# Altium project FLS Data Formatter 8_14_2012.PrjPCB
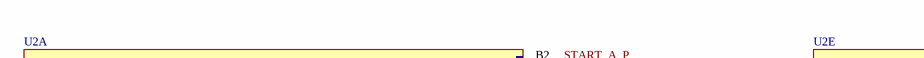
[diagram p0: M2FS FLS Data Formatter 8_14_2012.SchDoc, top right]
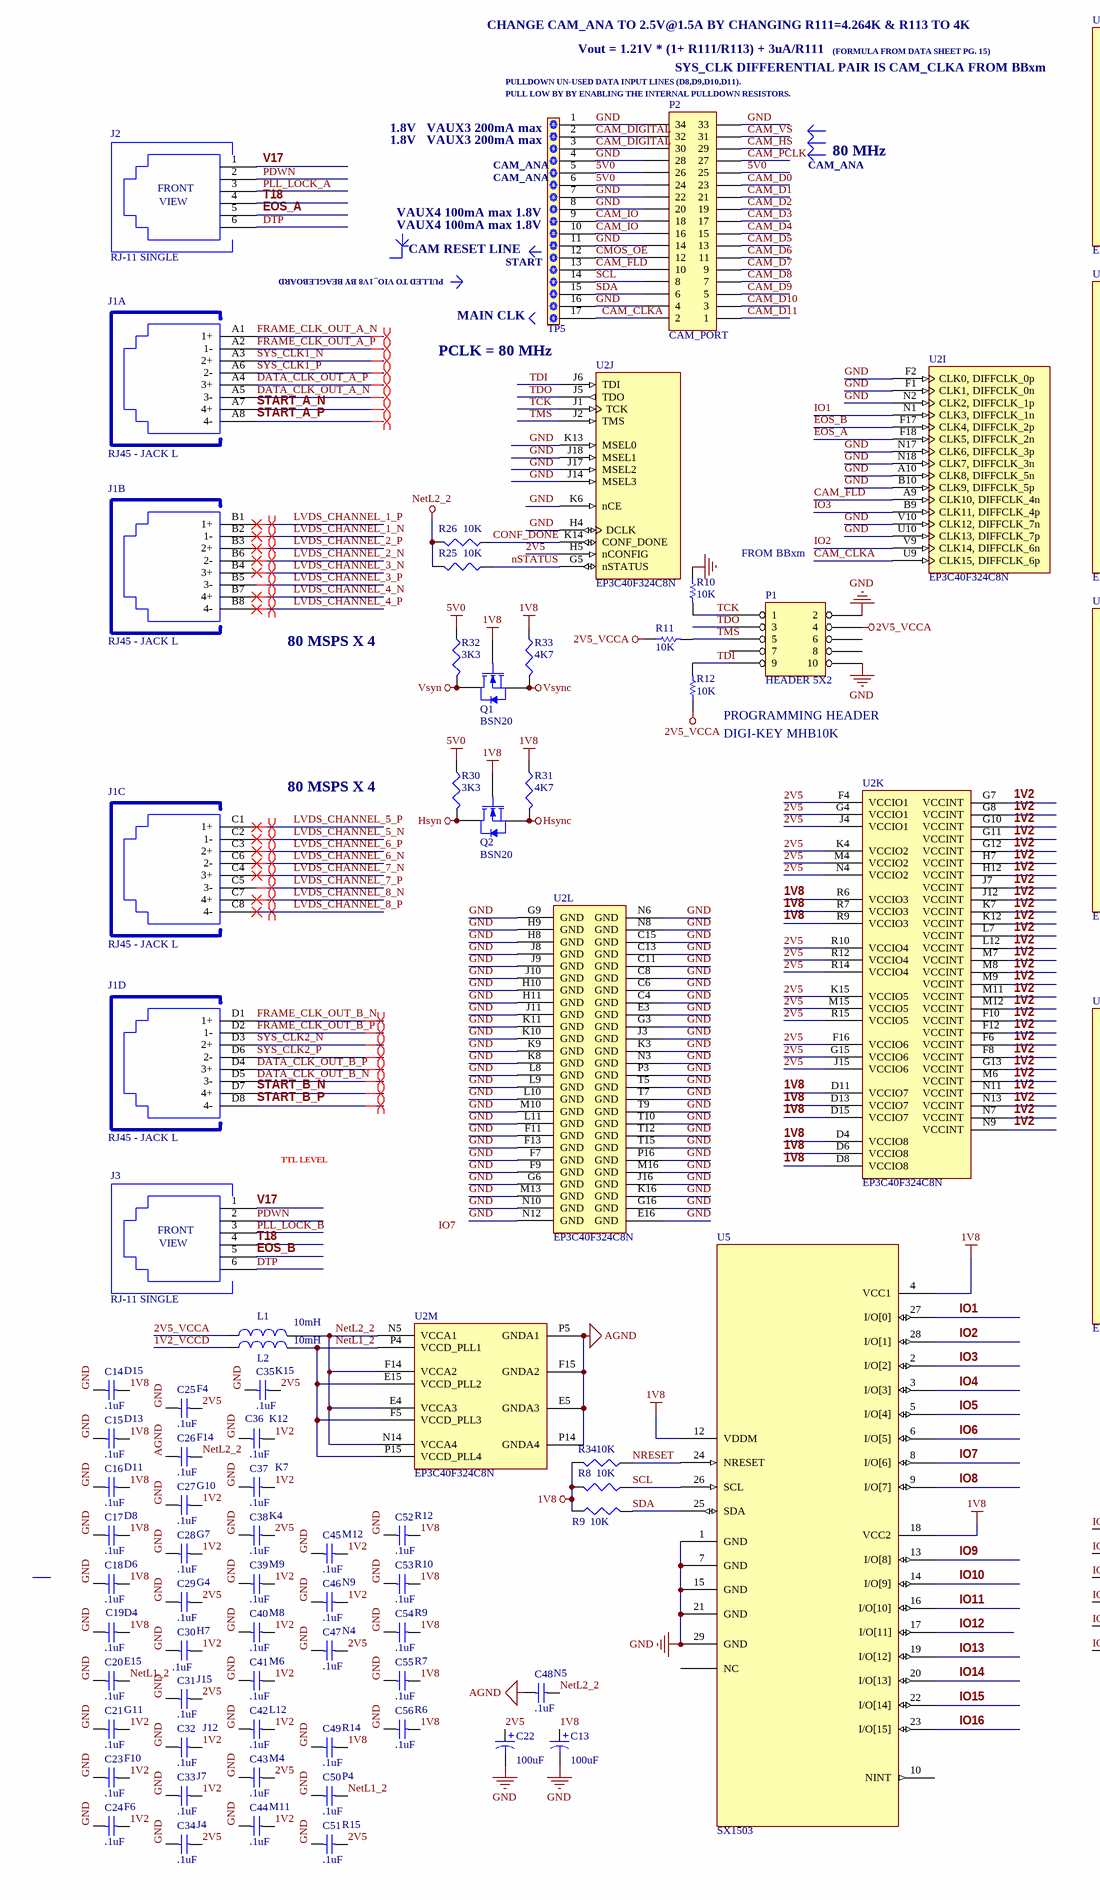
[diagram p1: M2FS FLS Data Formatter 8_14_2012.SchDoc, bottom left]
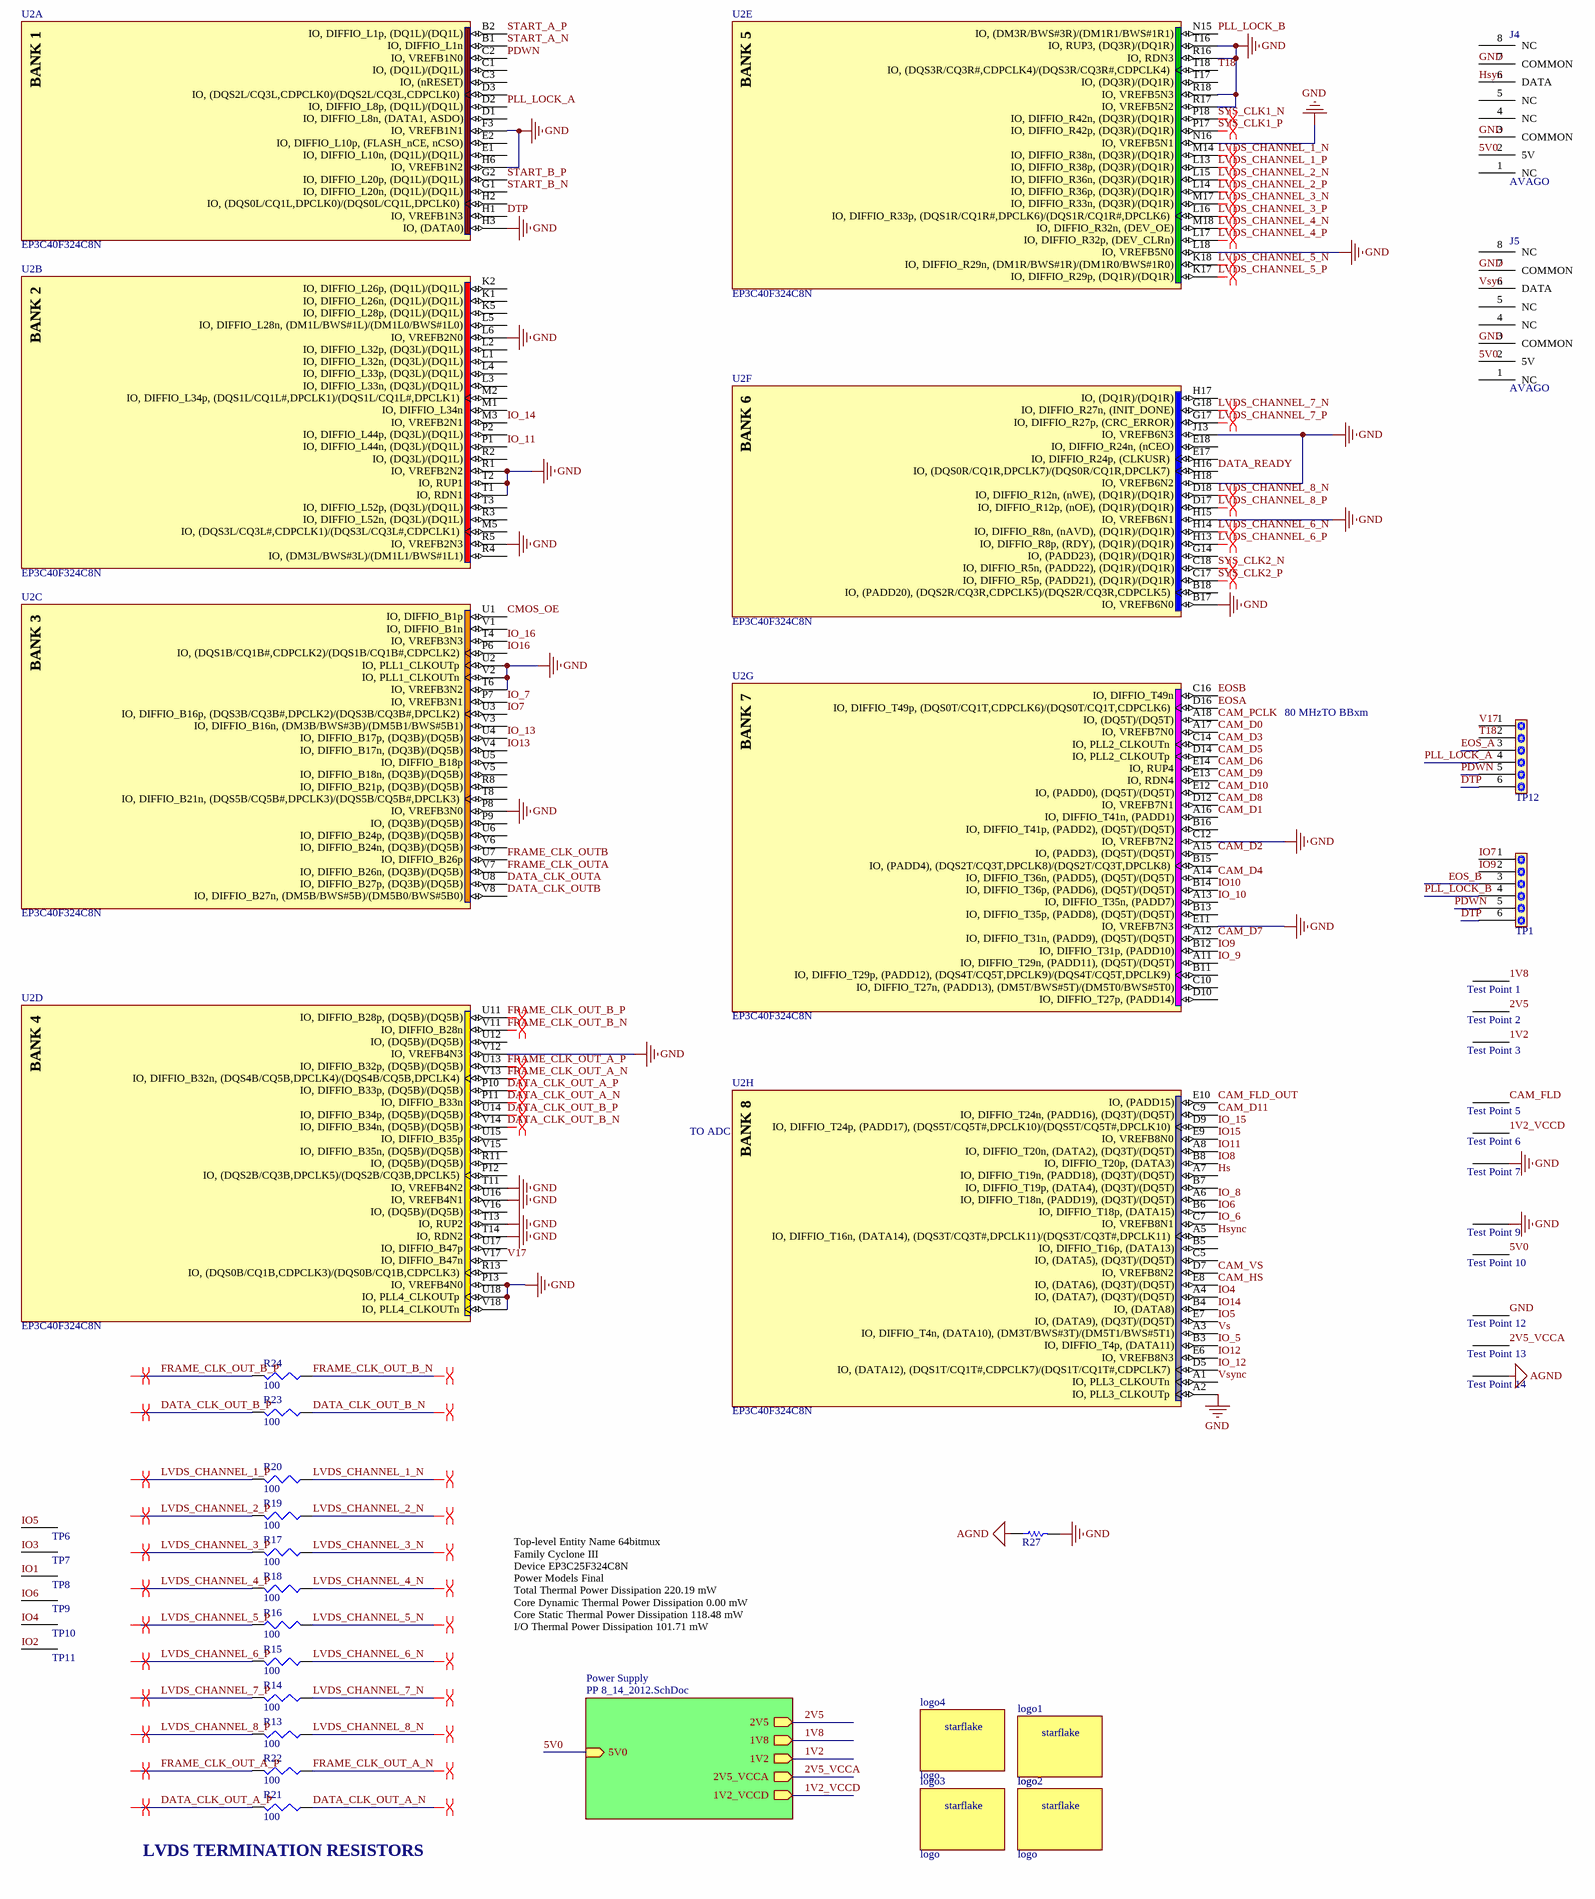
[diagram p2: M2FS FLS Data Formatter 8_14_2012.SchDoc, bottom right]
2 sheets, 134 parts. Net scope: hierarchical (ports join the sheet entries above them; power ports are global).
Board file: M2FS FLS Data Formatter 8_14_2012.PcbDoc
Sheets:
  M2FS FLS Data Formatter 8_14_2012.SchDoc
    Power Supply = PP 8_14_2012.SchDoc

## Sheet M2FS FLS Data Formatter 8_14_2012.SchDoc
size 558 x 401 mm; Organization: Carnegie Institution of Washington; DocumentNumber: 2; SheetNumber: 2; SheetTotal: 2; CompanyName: Carnegie Observatories; DrawnBy: alanb; Engineer: Alan Bagish; PageSetup: Record=PageOptions|CenterHorizontal=True|CenterVertical=True|PrintScale=0.47|XCorrection=1.00|YCorrection=1.00|PrintKind=0|BorderSize=5000000|LeftOffset=0|BottomOffset=0|Orientation=2|PaperLength=1000|PaperWidth=1000|Scale=100|PaperSource=259|PrintQuality=600|MediaType=1|DitherType=10|PaperKind=Letter (8.5 x 11")|PrintScaleMode=1; DocumentName: FLS FRONT END

### Parts
C13  100uF  [1206]
C14  value .1uF  Ball: D15  [0402 slim]  (hidden comment: 0.1uF)
C15  value .1uF  Ball: D13  [0402 slim]  (hidden comment: 0.1uF)
C16  value .1uF  Ball: D11  [0402 slim-B]  (hidden comment: 0.1uF)
C17  value .1uF  Ball: D8  [0402 slim]  (hidden comment: 0.1uF)
C18  value .1uF  Ball: D6  [0402 slim-B]  (hidden comment: 0.1uF)
C19  value .1uF  Ball: D4  [0402 slim]  (hidden comment: 0.1uF)
C20  value .1uF  Ball: E15  [0402 slim-B]  (hidden comment: 0.1uF)
C21  value .1uF  Ball: G11  [0402 slim]  (hidden comment: 0.1uF)
C22  100uF  [1206]
C23  value .1uF  Ball: F10  [0402 slim-B]  (hidden comment: 0.1uF)
C24  value .1uF  Ball: F6  [0402 slim]  (hidden comment: 0.1uF)
C25  value .1uF  Ball: F4  [0402 slim]  (hidden comment: 0.1uF)
C26  value .1uF  Ball: F14  [0402 slim]  (hidden comment: 0.1uF)
C27  value .1uF  Ball: G10  [0402 slim]  (hidden comment: 0.1uF)
C28  value .1uF  Ball: G7  [0402 slim-B]  (hidden comment: 0.1uF)
C29  value .1uF  Ball: G4  [0402 slim]  (hidden comment: 0.1uF)
C30  value .1uF  Ball: H7  [0402 slim-B]  (hidden comment: 0.1uF)
C31  value .1uF  Ball: J15  [0402 slim]  (hidden comment: 0.1uF)
C32  value .1uF  Ball: J12  [0402 slim-B]  (hidden comment: 0.1uF)
C33  value .1uF  Ball: J7  [0402 slim-B]  (hidden comment: 0.1uF)
C34  value .1uF  C34: J4  [0402 slim]  (hidden comment: 0.1uF)
C35  value .1uF  Ball: K15  [0402 slim]  (hidden comment: 0.1uF)
C36  value .1uF  Ball: K12  [0402 slim]  (hidden comment: 0.1uF)
C37  value .1uF  Ball: K7  [0402 slim-B]  (hidden comment: 0.1uF)
C38  value .1uF  Ball: K4  [0402 slim]  (hidden comment: 0.1uF)
C39  value .1uF  Ball: M9  [0402 slim]  (hidden comment: 0.1uF)
C40  value .1uF  Ball: M8  [0402 slim-B]  (hidden comment: 0.1uF)
C41  value .1uF  Ball: M6  [0402 slim]  (hidden comment: 0.1uF)
C42  value .1uF  Ball: L12  [0402 slim]  (hidden comment: 0.1uF)
C43  value .1uF  Ball: M4  [0402 slim]  (hidden comment: 0.1uF)
C44  value .1uF  Ball: M11  [0402 slim]  (hidden comment: 0.1uF)
C45  value .1uF  Ball: M12  [0402 slim-B]  (hidden comment: 0.1uF)
C46  value .1uF  Ball: N9  [0402 slim]  (hidden comment: 0.1uF)
C47  value .1uF  Bal: N4  [0402 slim]  (hidden comment: 0.1uF)
C48  value .1uF  Ball: N5  [0402 slim]  (hidden comment: 0.1uF)
C49  value .1uF  Ball: R14  [0402 slim]  (hidden comment: 0.1uF)
C50  value .1uF  Ball: P4  [0402 slim]  (hidden comment: 0.1uF)
C51  value .1uF  Ball: R15  [0402 slim]  (hidden comment: 0.1uF)
C52  value .1uF  Ball: R12  [0402 slim]  (hidden comment: 0.1uF)
C53  value .1uF  Ball: R10  [0402 slim]  (hidden comment: 0.1uF)
C54  value .1uF  Ball: R9  [0402 slim]  (hidden comment: 0.1uF)
C55  value .1uF  Ball: R7  [0402 slim]  (hidden comment: 0.1uF)
C56  value .1uF  Ball: R6  [0402 slim]  (hidden comment: 0.1uF)
J1  RJ45 - JACK L  [5558503-1 Quad RJ45 Jack]  (parts A,B,C,D of 4)
J2  RJ-11 SINGLE  [RJ11 - 5555140-1]
J3  RJ-11 SINGLE  [RJ11 - 5555140-1]
J4  AVAGO  [HFBR-2412Z]
J5  AVAGO  [HFBR-2412Z]
L1  value 10mH  [0805]  (hidden comment: Inductor)
L2  value 10mH  [0805]  (hidden comment: Inductor)
logo1  logo  [STARFLAKE]
logo2  logo  [STARFLAKE]
logo3  logo  [STARFLAKE]
logo4  logo  [STARFLAKE]
P1  HEADER 5X2  [HDR2X5]
P2  CAM_PORT  [CON34_.05X.05]
Q1  BSN20  [SOT23]
Q2  BSN20  [SOT23]
R8  10K  [0402 slim]
R9  10K  [0402 slim]
R10  10K  [6-0805]
R11  10K  [6-0805]
R12  10K  [6-0805]
R13  100  [0402 slim]
R14  100  [0402 slim]
R15  100  [0402 slim]
R16  100  [0402 slim]
R17  100  [0402 one-of]
R18  100  [0402 slim]
R19  100  [0402 slim]
R20  100  [0402 slim]
R21  100  [0402 slim]
R22  100  [0402 slim]
R23  100  [0402 slim]
R24  100  [0402 slim]
R25  10K  [0805]
R26  10K  [0805]
R27  0R5 0805(2012)  [RESC0805(2012)_N]  (value not drawn)
R30  3K3  [0805]
R31  4K7  [0805]
R32  3K3  [0805]
R33  4K7  [0805]
R34  10K  [0402 slim]
Test_Point_1  TP-107  (value not drawn)
Test_Point_2  TP-107  (value not drawn)
Test_Point_3  TP-107  (value not drawn)
Test_Point_5  TP-107  (value not drawn)
Test_Point_6  TP-107  [TP-107]  (value not drawn)
Test_Point_7  TP-107  (value not drawn)
Test_Point_9  TP-107  (value not drawn)
Test_Point_10  TP-107  (value not drawn)
Test_Point_12  TP-107  [TP-107]  (value not drawn)
Test_Point_13  TP-107  [TP-107]  (value not drawn)
Test_Point_14  TP-107  [TP-107]  (value not drawn)
TP1  TP6  [TP6]  (value not drawn)
TP5  TP17  [TP17]  (value not drawn)
TP6  IO5  [TP1]  (value not drawn)
TP7  IO3  [TP1]  (value not drawn)
TP8  IO1  [TP1]  (value not drawn)
TP9  IO6  [TP1]  (value not drawn)
TP10  IO4  [TP1]  (value not drawn)
TP11  IO2  [TP1]  (value not drawn)
TP12  TP6  [TP6]  (value not drawn)
U2  EP3C40F324C8N  [FBGA324]  (parts A,B,C,D,E,F,G,H,I,J,K,L,M of 13)
U5  SX1503  [QFN-UT28]

### Sub-sheets
Power Supply = PP 8_14_2012.SchDoc: 5V0 (in), 2V5 (out), 1V8 (out), 1V2 (out), 1V2_VCCD (out), 2V5_VCCA (out)

### Nets
1V8: C13.1 C14.1 C15.1 C16.2 C17.1 C18.2 C19.1 C49.1 C52.1 C53.1 C54.1 C55.1 C56.1 Q1.1(G) Q2.1(G) R8.2 R9.1 R31.1 R33.1 R34.2 Test_Point_1.1 U2.D4(VCCIO8) U2.D6(VCCIO8) U2.D8(VCCIO8) U2.D11(VCCIO7) U2.D13(VCCIO7) U2.D15(VCCIO7) U2.R6(VCCIO3) U2.R7(VCCIO3) U2.R9(VCCIO3) U5.4(VCC1) U5.12(VDDM) U5.18(VCC2) ; sheet Power Supply/1V8
2V5_VCCA: L1.1 P1.4 R11.1 R12.1 Test_Point_13.1 ; sheet Power Supply/2V5_VCCA
5V0: J4.2(5V) J5.2(5V) P2.24 P2.25 P2.26 R30.1 R32.1 Test_Point_10.1 TP5.5 TP5.6 ; sheet Power Supply/5V0
AGND: C26.2 C48.2 R27.1 Test_Point_14.1 U2.E5(GNDA3) U2.F15(GNDA2) U2.P5(GNDA1) U2.P14(GNDA4)
GND: C13.2 C14.2 C15.2 C16.1 C17.2 C18.1 C19.2 C20.1 C21.2 C22.2 C23.1 C24.2 C25.2 C27.2 C28.1 C29.2 C30.1 C31.1 C32.1 C33.1 C34.2 C35.2 C36.2 C37.1 C38.2 C39.2 C40.1 C41.2 C42.2 C43.2 C44.2 C45.1 C46.2 C47.2 C49.2 C50.2 C51.1 C52.2 C53.2 C54.2 C55.2 C56.2 J4.3(COMMON) J4.7(COMMON) J5.3(COMMON) J5.7(COMMON) P1.2 P1.10 P2.4 P2.14 P2.20 P2.22 P2.28 P2.33 P2.34 R10.1 R27.2 Test_Point_7.1 Test_Point_9.1 Test_Point_12.1 TP5.1 TP5.4 TP5.7 TP5.8 TP5.11 TP5.16 U2.A2(IO,_PLL3_CLKOUTp) U2.A10(CLK8,_DIFFCLK_5n) U2.B10(CLK9,_DIFFCLK_5p) U2.B17(IO,_VREFB6N0) U2.C4(GND) U2.C6(GND) U2.C8(GND) U2.C11(GND) U2.C12(IO,_VREFB7N2) U2.C13(GND) U2.C15(GND) U2.E3(GND) U2.E11(IO,_VREFB7N3) U2.E16(GND) U2.F1(CLK1,_DIFFCLK_0n) U2.F2(CLK0,_DIFFCLK_0p) U2.F3(IO,_VREFB1N1) U2.F7(GND) U2.F9(GND) U2.F11(GND) U2.F13(GND) U2.G3(GND) U2.G6(GND) U2.G9(GND) U2.G16(GND) U2.H3(IO,_(DATA0)) U2.H4(DCLK) U2.H6(IO,_VREFB1N2) U2.H8(GND) U2.H9(GND) U2.H10(GND) U2.H11(GND) U2.H15(IO,_VREFB6N1) U2.H18(IO,_VREFB6N2) U2.J3(GND) U2.J8(GND) U2.J9(GND) U2.J10(GND) U2.J11(GND) U2.J13(IO,_VREFB6N3) U2.J14(MSEL3) U2.J16(GND) U2.J17(MSEL2) U2.J18(MSEL1) U2.K3(GND) U2.K6(nCE) U2.K8(GND) U2.K9(GND) U2.K10(GND) U2.K11(GND) U2.K13(MSEL0) U2.K16(GND) U2.L6(IO,_VREFB2N0) U2.L8(GND) U2.L9(GND) U2.L10(GND) U2.L11(GND) U2.L18(IO,_VREFB5N0) U2.M10(GND) U2.M13(GND) U2.M16(GND) U2.N2(CLK2,_DIFFCLK_1p) U2.N3(GND) U2.N6(GND) U2.N8(GND) U2.N10(GND) U2.N12(GND) U2.N16(IO,_VREFB5N1) U2.N17(CLK6,_DIFFCLK_3p) U2.N18(CLK7,_DIFFCLK_3n) U2.P3(GND) U2.P8(IO,_VREFB3N0) U2.P13(IO,_VREFB4N0) U2.P16(GND) U2.R1(IO,_VREFB2N2) U2.R5(IO,_VREFB2N3) U2.R16(IO,_RDN3) U2.R17(IO,_VREFB5N2) U2.R18(IO,_VREFB5N3) U2.T1(IO,_RDN1) U2.T2(IO,_RUP1) U2.T5(GND) U2.T6(IO,_VREFB3N2) U2.T7(GND) U2.T9(GND) U2.T10(GND) U2.T11(IO,_VREFB4N2) U2.T12(GND) U2.T13(IO,_RUP2) U2.T14(IO,_RDN2) U2.T15(GND) U2.T16(IO,_RUP3,_(DQ3R)/(DQ1R)) U2.U2(IO,_PLL1_CLKOUTp) U2.U10(CLK13,_DIFFCLK_7p) U2.U16(IO,_VREFB4N1) U2.U18(IO,_PLL4_CLKOUTp) U2.V2(IO,_PLL1_CLKOUTn) U2.V10(CLK12,_DIFFCLK_7n) U2.V12(IO,_VREFB4N3) U2.V18(IO,_PLL4_CLKOUTn) U5.1(GND) U5.7(GND) U5.15(GND) U5.21(GND) U5.29(GND)
Hsyn: J4.6(DATA) Q2.3(D) R30.2
Hsync: Q2.2(S) R31.2 U2.A5(IO,_DIFFIO_T16n,_(DATA14),_(DQS3T/CQ3T#,DPCLK11)/(DQS3T/CQ3T#,DPCLK11))
NetL2_2: C26.1 C48.1 L1.2 R25.2 R26.2 U2.E4(VCCA3) U2.F14(VCCA2) U2.N5(VCCA1) U2.N14(VCCA4)
Vsyn: J5.6(DATA) Q1.3(D) R32.2
Vsync: Q1.2(S) R33.2 U2.A1(IO,_PLL3_CLKOUTn)
1V2: C21.1 C23.2 C24.1 C27.1 C28.2 C30.2 C32.2 C33.2 C36.1 C37.2 C39.1 C40.2 C41.1 C42.1 C44.1 C45.2 C46.1 Test_Point_3.1 U2.F6(VCCINT) U2.F8(VCCINT) U2.F10(VCCINT) U2.F12(VCCINT) U2.G7(VCCINT) U2.G8(VCCINT) U2.G10(VCCINT) U2.G11(VCCINT) U2.G12(VCCINT) U2.G13(VCCINT) U2.H7(VCCINT) U2.H12(VCCINT) U2.J7(VCCINT) U2.J12(VCCINT) U2.K7(VCCINT) U2.K12(VCCINT) U2.L7(VCCINT) U2.L12(VCCINT) U2.M6(VCCINT) U2.M7(VCCINT) U2.M8(VCCINT) U2.M9(VCCINT) U2.M11(VCCINT) U2.M12(VCCINT) U2.N7(VCCINT) U2.N9(VCCINT) U2.N11(VCCINT) U2.N13(VCCINT) ; sheet Power Supply/1V2
1V2_VCCD: L2.1 Test_Point_6.1 ; sheet Power Supply/1V2_VCCD
2V5: C22.1 C25.1 C29.1 C31.2 C34.1 C35.1 C38.1 C43.1 C47.1 C51.2 Test_Point_2.1 U2.F4(VCCIO1) U2.F16(VCCIO6) U2.G4(VCCIO1) U2.G15(VCCIO6) U2.H5(nCONFIG) U2.J4(VCCIO1) U2.J15(VCCIO6) U2.K4(VCCIO2) U2.K15(VCCIO5) U2.M4(VCCIO2) U2.M15(VCCIO5) U2.N4(VCCIO2) U2.R10(VCCIO4) U2.R12(VCCIO4) U2.R14(VCCIO4) U2.R15(VCCIO5) ; sheet Power Supply/2V5
CAM_CLKA: P2.2 TP5.17 U2.U9(CLK15,_DIFFCLK_6p)
CAM_D0: P2.23 U2.A17(IO,_VREFB7N0)
CAM_D1: P2.21 U2.A16(IO,_DIFFIO_T41n,_(PADD1))
CAM_D2: P2.19 U2.A15(IO,_(PADD3),_(DQ5T)/(DQ5T))
CAM_D3: P2.17 U2.C14(IO,_PLL2_CLKOUTn)
CAM_D4: P2.15 U2.A14(IO,_DIFFIO_T36n,_(PADD5),_(DQ5T)/(DQ5T))
CAM_D5: P2.13 U2.D14(IO,_PLL2_CLKOUTp)
CAM_D6: P2.11 U2.E14(IO,_RUP4)
CAM_D7: P2.9 U2.A12(IO,_DIFFIO_T31n,_(PADD9),_(DQ5T)/(DQ5T))
CAM_D8: P2.7 U2.D12(IO,_VREFB7N1)
CAM_D9: P2.5 U2.E13(IO,_RDN4)
CAM_D10: P2.3 U2.E12(IO,_(PADD0),_(DQ5T)/(DQ5T))
CAM_D11: P2.1 U2.C9(IO,_DIFFIO_T24n,_(PADD16),_(DQ3T)/(DQ5T))
CAM_DIGITAL: P2.30 P2.32 TP5.2 TP5.3
CAM_FLD: P2.10 Test_Point_5.1 TP5.13 U2.A9(CLK10,_DIFFCLK_4n)
CAM_FLD_OUT: U2.E10(IO,_(PADD15))
CAM_HS: P2.29 U2.E8(IO,_(DATA6),_(DQ3T)/(DQ5T))
CAM_IO: P2.16 P2.18 TP5.9 TP5.10
CAM_PCLK: P2.27 U2.A18(IO,_(DQ5T)/(DQ5T))
CAM_VS: P2.31 U2.D7(IO,_VREFB8N2)
CMOS_OE: P2.12 TP5.12 U2.U1(IO,_DIFFIO_B1p)
CONF_DONE: R26.1 U2.K14(CONF_DONE)
DATA_CLK_OUT_A_N: J1.A5(3-) R21.1 U2.P11(IO,_DIFFIO_B33n)
DATA_CLK_OUT_A_P: J1.A4(3+) R21.2 U2.P10(IO,_DIFFIO_B33p,_(DQ5B)/(DQ5B))
DATA_CLK_OUT_B_N: J1.D5(3-) R23.1 U2.V14(IO,_DIFFIO_B34n,_(DQ5B)/(DQ5B))
DATA_CLK_OUT_B_P: J1.D4(3+) R23.2 U2.U14(IO,_DIFFIO_B34p,_(DQ5B)/(DQ5B))
DATA_CLK_OUTA: U2.U8(IO,_DIFFIO_B27p,_(DQ3B)/(DQ5B))
DATA_CLK_OUTB: U2.V8(IO,_DIFFIO_B27n,_(DM5B/BWS#5B)/(DM5B0/BWS#5B0))
DATA_READY: U2.H16(IO,_(DQS0R/CQ1R,DPCLK7)/(DQS0R/CQ1R,DPCLK7))
DTP: J2.6(TX-) J3.6(TX-) TP1.6 TP12.6 U2.H1(IO,_VREFB1N3)
EOS_A: J2.5 TP12.3 U2.F18(CLK5,_DIFFCLK_2n)
EOS_B: J3.5 TP1.3 U2.F17(CLK4,_DIFFCLK_2p)
EOSA: U2.D16(IO,_DIFFIO_T49p,_(DQS0T/CQ1T,CDPCLK6)/(DQS0T/CQ1T,CDPCLK6))
EOSB: U2.C16(IO,_DIFFIO_T49n)
FRAME_CLK_OUT_A_N: J1.A1(1+) R22.1 U2.V13(IO,_DIFFIO_B32n,_(DQS4B/CQ5B,DPCLK4)/(DQS4B/CQ5B,DPCLK4))
FRAME_CLK_OUT_A_P: J1.A2(1-) R22.2 U2.U13(IO,_DIFFIO_B32p,_(DQ5B)/(DQ5B))
FRAME_CLK_OUT_B_N: J1.D1(1+) R24.1 U2.V11(IO,_DIFFIO_B28n)
FRAME_CLK_OUT_B_P: J1.D2(1-) R24.2 U2.U11(IO,_DIFFIO_B28p,_(DQ5B)/(DQ5B))
FRAME_CLK_OUTA: U2.V7(IO,_DIFFIO_B26n,_(DQ3B)/(DQ5B))
FRAME_CLK_OUTB: U2.U7(IO,_DIFFIO_B26p)
Hs: U2.A7(IO,_DIFFIO_T19n,_(PADD18),_(DQ3T)/(DQ5T))
IO1: TP8.1(TP) U2.N1(CLK3,_DIFFCLK_1n) U5.27(I/O[0])
IO2: TP11.1(TP) U2.V9(CLK14,_DIFFCLK_6n) U5.28(I/O[1])
IO3: TP7.1(TP) U2.B9(CLK11,_DIFFCLK_4p) U5.2(I/O[2])
IO4: TP10.1(TP) U2.A4(IO,_(DATA7),_(DQ3T)/(DQ5T)) U5.3(I/O[3])
IO5: TP6.1(TP) U2.E7(IO,_(DATA9),_(DQ3T)/(DQ5T)) U5.5(I/O[4])
IO6: TP9.1(TP) U2.B6(IO,_DIFFIO_T18p,_(DATA15)) U5.6(I/O[5])
IO7: TP1.1 U2.U3(IO,_DIFFIO_B16p,_(DQS3B/CQ3B#,DPCLK2)/(DQS3B/CQ3B#,DPCLK2)) U5.8(I/O[6])
IO8: U2.B8(IO,_DIFFIO_T20p,_(DATA3)) U5.9(I/O[7])
IO9: TP1.2 U2.B12(IO,_DIFFIO_T31p,_(PADD10)) U5.13(I/O[8])
IO10: U2.B14(IO,_DIFFIO_T36p,_(PADD6),_(DQ5T)/(DQ5T)) U5.14(I/O[9])
IO11: U2.A8(IO,_DIFFIO_T20n,_(DATA2),_(DQ3T)/(DQ5T)) U5.16(I/O[10])
IO12: U2.E6(IO,_VREFB8N3) U5.17(I/O[11])
IO13: U2.V4(IO,_DIFFIO_B17n,_(DQ3B)/(DQ5B)) U5.19(I/O[12])
IO14: U2.B4(IO,_(DATA8)) U5.20(I/O[13])
IO15: U2.E9(IO,_VREFB8N0) U5.22(I/O[14])
IO16: U2.P6(IO,_(DQS1B/CQ1B#,CDPCLK2)/(DQS1B/CQ1B#,CDPCLK2)) U5.23(I/O[15])
IO_5: U2.B3(IO,_DIFFIO_T4p,_(DATA11))
IO_6: U2.C7(IO,_VREFB8N1)
IO_7: U2.P7(IO,_VREFB3N1)
IO_8: U2.A6(IO,_DIFFIO_T18n,_(PADD19),_(DQ3T)/(DQ5T))
IO_9: U2.A11(IO,_DIFFIO_T29n,_(PADD11),_(DQ5T)/(DQ5T))
IO_10: U2.A13(IO,_DIFFIO_T35n,_(PADD7))
IO_11: U2.P1(IO,_DIFFIO_L44n,_(DQ3L)/(DQ1L))
IO_12: U2.D5(IO,_(DATA12),_(DQS1T/CQ1T#,CDPCLK7)/(DQS1T/CQ1T#,CDPCLK7))
IO_13: U2.U4(IO,_DIFFIO_B17p,_(DQ3B)/(DQ5B))
IO_14: U2.M3(IO,_VREFB2N1)
IO_15: U2.D9(IO,_DIFFIO_T24p,_(PADD17),_(DQS5T/CQ5T#,DPCLK10)/(DQS5T/CQ5T#,DPCLK10))
IO_16: U2.T4(IO,_VREFB3N3)
LVDS_CHANNEL_1_N: J1.B2(1-) R20.1 U2.M14(IO,_DIFFIO_R38n,_(DQ3R)/(DQ1R))
LVDS_CHANNEL_1_P: J1.B1(1+) R20.2 U2.L13(IO,_DIFFIO_R38p,_(DQ3R)/(DQ1R))
LVDS_CHANNEL_2_N: J1.B6(2-) R19.1 U2.L15(IO,_DIFFIO_R36n,_(DQ3R)/(DQ1R))
LVDS_CHANNEL_2_P: J1.B3(2+) R19.2 U2.L14(IO,_DIFFIO_R36p,_(DQ3R)/(DQ1R))
LVDS_CHANNEL_3_N: J1.B4(3+) R17.1 U2.M17(IO,_DIFFIO_R33n,_(DQ3R)/(DQ1R))
LVDS_CHANNEL_3_P: J1.B5(3-) R17.2 U2.L16(IO,_DIFFIO_R33p,_(DQS1R/CQ1R#,DPCLK6)/(DQS1R/CQ1R#,DPCLK6))
LVDS_CHANNEL_4_N: J1.B7(4+) R18.1 U2.M18(IO,_DIFFIO_R32n,_(DEV_OE))
LVDS_CHANNEL_4_P: J1.B8(4-) R18.2 U2.L17(IO,_DIFFIO_R32p,_(DEV_CLRn))
LVDS_CHANNEL_5_N: J1.C2(1-) R16.2 U2.K18(IO,_DIFFIO_R29n,_(DM1R/BWS#1R)/(DM1R0/BWS#1R0))
LVDS_CHANNEL_5_P: J1.C1(1+) R16.1 U2.K17(IO,_DIFFIO_R29p,_(DQ1R)/(DQ1R))
LVDS_CHANNEL_6_N: J1.C6(2-) R15.1 U2.H14(IO,_DIFFIO_R8n,_(nAVD),_(DQ1R)/(DQ1R))
LVDS_CHANNEL_6_P: J1.C3(2+) R15.2 U2.H13(IO,_DIFFIO_R8p,_(RDY),_(DQ1R)/(DQ1R))
LVDS_CHANNEL_7_N: J1.C4(3+) R14.1 U2.G18(IO,_DIFFIO_R27n,_(INIT_DONE))
LVDS_CHANNEL_7_P: J1.C5(3-) R14.2 U2.G17(IO,_DIFFIO_R27p,_(CRC_ERROR))
LVDS_CHANNEL_8_N: J1.C7(4+) R13.1 U2.D18(IO,_DIFFIO_R12n,_(nWE),_(DQ1R)/(DQ1R))
LVDS_CHANNEL_8_P: J1.C8(4-) R13.2 U2.D17(IO,_DIFFIO_R12p,_(nOE),_(DQ1R)/(DQ1R))
NetL1_2: C20.2 C50.1 L2.2 U2.E15(VCCD_PLL2) U2.F5(VCCD_PLL3) U2.P4(VCCD_PLL1) U2.P15(VCCD_PLL4)
NRESET: R34.1 U5.24(NRESET)
nSTATUS: R25.1 U2.G5(nSTATUS)
PDWN: J2.2(RX-) J3.2(RX-) TP1.5 TP12.5 U2.C2(IO,_VREFB1N0)
PLL_LOCK_A: J2.3(TX+) TP12.4 U2.D2(IO,_DIFFIO_L8p,_(DQ1L)/(DQ1L))
PLL_LOCK_B: J3.3(TX+) TP1.4 U2.N15(IO,_(DM3R/BWS#3R)/(DM1R1/BWS#1R1))
SCL: P2.8 R8.1 TP5.14 U5.26(SCL)
SDA: P2.6 R9.2 TP5.15 U5.25(SDA)
START_A_N: J1.A7(4+) U2.B1(IO,_DIFFIO_L1n)
START_A_P: J1.A8(4-) U2.B2(IO,_DIFFIO_L1p,_(DQ1L)/(DQ1L))
START_B_N: J1.D7(4+) U2.G1(IO,_DIFFIO_L20n,_(DQ1L)/(DQ1L))
START_B_P: J1.D8(4-) U2.G2(IO,_DIFFIO_L20p,_(DQ1L)/(DQ1L))
SYS_CLK1_N: J1.A3(2+) U2.P18(IO,_DIFFIO_R42n,_(DQ3R)/(DQ1R))
SYS_CLK1_P: J1.A6(2-) U2.P17(IO,_DIFFIO_R42p,_(DQ3R)/(DQ1R))
SYS_CLK2_N: J1.D3(2+) U2.C18(IO,_DIFFIO_R5n,_(PADD22),_(DQ1R)/(DQ1R))
SYS_CLK2_P: J1.D6(2-) U2.C17(IO,_DIFFIO_R5p,_(PADD21),_(DQ1R)/(DQ1R))
T18: J2.4 J3.4 TP12.2 U2.T18(IO,_(DQS3R/CQ3R#,CDPCLK4)/(DQS3R/CQ3R#,CDPCLK4))
TCK: P1.1 R10.2 U2.J1(TCK)
TDI: P1.9 R12.2 U2.J6(TDI)
TDO: P1.3 U2.J5(TDO)
TMS: P1.5 R11.2 U2.J2(TMS)
V17: J2.1(RX+) J3.1(RX+) TP12.1 U2.V17(IO,_DIFFIO_B47n)
Vs: U2.A3(IO,_DIFFIO_T4n,_(DATA10),_(DM3T/BWS#3T)/(DM5T1/BWS#5T1))

Not connected (* = marked no-connect by the designer): J4 1(NC) 4(NC) 5(NC) 8(NC); J5 1(NC) 4(NC) 5(NC) 8(NC); P1 6 7 8; U2 B5(IO,_DIFFIO_T16p,_(DATA13)) B7(IO,_DIFFIO_T19p,_(DATA4),_(DQ3T)/(DQ5T)) B11(IO,_DIFFIO_T29p,_(PADD12),_(DQS4T/CQ5T,DPCLK9)/(DQS4T/CQ5T,DPCLK9)) B13(IO,_DIFFIO_T35p,_(PADD8),_(DQ5T)/(DQ5T)) B15(IO,_(PADD4),_(DQS2T/CQ3T,DPCLK8)/(DQS2T/CQ3T,DPCLK8)) B16(IO,_DIFFIO_T41p,_(PADD2),_(DQ5T)/(DQ5T)) B18(IO,_(PADD20),_(DQS2R/CQ3R,CDPCLK5)/(DQS2R/CQ3R,CDPCLK5)) C1(IO,_(DQ1L)/(DQ1L)) C3(IO,_(nRESET)) C5(IO,_(DATA5),_(DQ3T)/(DQ5T)) C10(IO,_DIFFIO_T27n,_(PADD13),_(DM5T/BWS#5T)/(DM5T0/BWS#5T0)) D1(IO,_DIFFIO_L8n,_(DATA1,_ASDO)) D3(IO,_(DQS2L/CQ3L,CDPCLK0)/(DQS2L/CQ3L,CDPCLK0)) D10(IO,_DIFFIO_T27p,_(PADD14)) E1(IO,_DIFFIO_L10n,_(DQ1L)/(DQ1L)) E2(IO,_DIFFIO_L10p,_(FLASH_nCE,_nCSO)) E17(IO,_DIFFIO_R24p,_(CLKUSR)) E18(IO,_DIFFIO_R24n,_(nCEO)) G14(IO,_(PADD23),_(DQ1R)/(DQ1R)) H2(IO,_(DQS0L/CQ1L,DPCLK0)/(DQS0L/CQ1L,DPCLK0)) H17(IO,_(DQ1R)/(DQ1R)) K1(IO,_DIFFIO_L26n,_(DQ1L)/(DQ1L)) K2(IO,_DIFFIO_L26p,_(DQ1L)/(DQ1L)) K5(IO,_DIFFIO_L28p,_(DQ1L)/(DQ1L)) L1(IO,_DIFFIO_L32n,_(DQ3L)/(DQ1L)) L2(IO,_DIFFIO_L32p,_(DQ3L)/(DQ1L)) L3(IO,_DIFFIO_L33n,_(DQ3L)/(DQ1L)) L4(IO,_DIFFIO_L33p,_(DQ3L)/(DQ1L)) L5(IO,_DIFFIO_L28n,_(DM1L/BWS#1L)/(DM1L0/BWS#1L0)) M1(IO,_DIFFIO_L34n) M2(IO,_DIFFIO_L34p,_(DQS1L/CQ1L#,DPCLK1)/(DQS1L/CQ1L#,DPCLK1)) M5(IO,_(DQS3L/CQ3L#,CDPCLK1)/(DQS3L/CQ3L#,CDPCLK1)) P2(IO,_DIFFIO_L44p,_(DQ3L)/(DQ1L)) P9(IO,_(DQ3B)/(DQ5B)) P12(IO,_(DQS2B/CQ3B,DPCLK5)/(DQS2B/CQ3B,DPCLK5)) R2(IO,_(DQ3L)/(DQ1L)) R3(IO,_DIFFIO_L52n,_(DQ3L)/(DQ1L)) R4(IO,_(DM3L/BWS#3L)/(DM1L1/BWS#1L1)) R8(IO,_DIFFIO_B21p,_(DQ3B)/(DQ5B)) R11(IO,_(DQ5B)/(DQ5B)) R13(IO,_(DQS0B/CQ1B,CDPCLK3)/(DQS0B/CQ1B,CDPCLK3)) T3(IO,_DIFFIO_L52p,_(DQ3L)/(DQ1L)) T8(IO,_DIFFIO_B21n,_(DQS5B/CQ5B#,DPCLK3)/(DQS5B/CQ5B#,DPCLK3)) T17(IO,_(DQ3R)/(DQ1R)) U5(IO,_DIFFIO_B18p) U6(IO,_DIFFIO_B24p,_(DQ3B)/(DQ5B)) U12(IO,_(DQ5B)/(DQ5B)) U15(IO,_DIFFIO_B35p) U17(IO,_DIFFIO_B47p) V1(IO,_DIFFIO_B1n) V3(IO,_DIFFIO_B16n,_(DM3B/BWS#3B)/(DM5B1/BWS#5B1)) V5(IO,_DIFFIO_B18n,_(DQ3B)/(DQ5B)) V6(IO,_DIFFIO_B24n,_(DQ3B)/(DQ5B)) V15(IO,_DIFFIO_B35n,_(DQ5B)/(DQ5B)) V16(IO,_(DQ5B)/(DQ5B)); U5 10(NINT) 11(NC)

### Layout directives
differential pair: DATA_CLK_OUT_A_N, DATA_CLK_OUT_A_P, DATA_CLK_OUT_B_N, DATA_CLK_OUT_B_P, FRAME_CLK_OUT_A_N, FRAME_CLK_OUT_A_P, FRAME_CLK_OUT_B_N, FRAME_CLK_OUT_B_P, LVDS_CHANNEL_1_N, LVDS_CHANNEL_1_P, LVDS_CHANNEL_2_N, LVDS_CHANNEL_2_P, LVDS_CHANNEL_3_N, LVDS_CHANNEL_3_P, LVDS_CHANNEL_4_N, LVDS_CHANNEL_4_P, LVDS_CHANNEL_5_N, LVDS_CHANNEL_5_P, LVDS_CHANNEL_6_N, LVDS_CHANNEL_6_P, LVDS_CHANNEL_7_N, LVDS_CHANNEL_7_P, LVDS_CHANNEL_8_N, LVDS_CHANNEL_8_P, START_A_N, START_A_P, START_B_N, START_B_P, SYS_CLK1_N, SYS_CLK1_P, SYS_CLK2_N, SYS_CLK2_P

### Notes on the sheet
- CHANGE CAM_ANA TO 2.5V@1.5A BY CHANGING R111=4.264K & R113 TO 4K
- PULLDOWN UN-USED DATA INPUT LINES (D8,D9,D10,D11).
- PULL LOW BY BY ENABLING THE INTERNAL PULLDOWN RESISTORS.
- Vout = 1.21V * (1+ R111/R113) + 3uA/R111
- SYS_CLK DIFFERENTIAL PAIR IS CAM_CLKA FROM BBxm
- (FORMULA FROM DATA SHEET PG. 15)
- 1.8V
- (near TP5) VAUX3 200mA max
- 80 MHz
- (near TP5) VAUX4 100mA max 1.8V
- (near TP5) CAM_ANA
- CAM_ANA
- CAM RESET LINE
- PULLED TO VIO_1V8 BY BEAGLEBOARD
- (near TP5) START
- MAIN CLK
- (near TP5) PCLK = 80 MHz
- FROM BBxm
- 80 MSPS X 4
- PROGRAMMING HEADER
- DIGI-KEY MHB10K
- 80 MHzTO BBxm
- TTL LEVEL
- TO ADC
- Top-level Entity Name	64bitmux
  Family	Cyclone III
  Device	EP3C25F324C8N
  Power Models	Final
  Total Thermal Power Dissipation	220.19 mW
  Core Dynamic Thermal Power Dissipation	0.00 mW
  Core Static Thermal Power Dissipation	118.48 mW
  I/O Thermal Power Dissipation	101.71 mW
- (near R21) LVDS TERMINATION RESISTORS
- Labels drawn without touching a wire or pin: IO7
- Carnegie Institution of Washington
- 813 Santa Barbara Street
- The Observatories
- PHONE (626) 577-1122               FAX (626) 795-8136
- Pasadena, California 91101
- Title:
- OCIW
- Size:
- Date:
- C
- Scale:
- Drawn By:
- Checked By:
- A. BAGISH
- alanb
- Revision:
- Sheet          of
- File:
- (in symbol EP3C40F324C8N, part A) BANK 1
- (in symbol EP3C40F324C8N, part B) BANK 2
- (in symbol EP3C40F324C8N, part C) BANK 3
- (in symbol EP3C40F324C8N, part D) BANK 4
- (in symbol EP3C40F324C8N, part E) BANK 5
- (in symbol EP3C40F324C8N, part F) BANK 6
- (in symbol EP3C40F324C8N, part G) BANK 7
- (in symbol EP3C40F324C8N, part H) BANK 8
- (in symbol RJ-11 SINGLE) FRONT; VIEW

### Library data of the parts
C13 C22 = Cap Pol3: Polarized Capacitor (Surface Mount); pin to pad: 1>2 2>1; Description: CAP TANT 100UF 10V 20% 1210; AVX Corporation: TAJB107M010RNJ; Published: 8-Jun-2000; LatestRevisionDate: 29-May-2009; LatestRevisionNote: IPC-7351 Footprint Added.; PackageReference: TC3528-1411; Publisher: Altium Limited; PackageDescription: Chip Capacitor; Value: 100uF; Digi-Key: 478-5801-6-ND
C14-C21 C23-C56 = Cap Semi: Capacitor (Semiconductor SIM Model); Description: CAP CER 0.1UF 25V Y5V 0805; Murata Electronics North America: GRM216F51E104ZA01D; Published: 8-Jun-2000; LatestRevisionDate: 29-May-2009; LatestRevisionNote: IPC-7351 Footprint Added.; PackageReference: 0805; Publisher: Altium Limited; PackageDescription: Chip Capacitor; Digi-Key: 490-1726-2-ND
J1 = RJ45 - JACK L: Manufacturer: TE Connectivity; Manufactuer Part Number: 5558503-1; Description: CONN MOD JACK 4PORT5 8-8 SHLD PCB; Number of Positions/Contacts: 8p8c (RJ45, Ethernet); Digi-Key Part Number: A31470-ND
J2 J3 = RJ-11 SINGLE: RJ-11 JACK
J4 J5 = HFBR-2412
L1 L2 = Inductor: Code_IEC: 1005; Published: 8-Jun-2000; LatestRevisionDate: 29-May-2009; LatestRevisionNote: IPC-7351 Footprint Added.; PackageReference: 0402-A; Publisher: Altium Limited; PackageDescription: Chip Inductor; Code_JEITA: 0402
logo1-logo4 = starflake
P1 = HEADER 5X2: Part Field 1: 1; Part Field 10: 1u; Part Field 2: 0; Part Field 3: 0; Part Field 4: 0; Part Field 5: 1; Part Field 6: 1K; Part Field 7: 1n; Part Field 8: 1n; Part Field 9: 500n
P2 = Header 17X2: Header, 17-Pin, Dual row; LatestRevisionDate: 17-Jul-2002; LatestRevisionNote: Re-released for DXP Platform.; Publisher: Altium Limited
Q1 Q2 = BSN20: N-channel Enhancement Mode FET; Published: 17-Sep-2003; LatestRevisionDate: 12-Dec-2006; LatestRevisionNote: IPC-7351 Footprint Added.; DatasheetVersion: 26-Jun-2000; PackageVersion: May-1999; PackageReference: SOT23; Publisher: Altium Limited; PackageDescription: 3-Pin SOT-23 Package 0.95 mm Pitch, 2.3 mm Lead Span; ComponentLink1Description: Manufacturer Link; ComponentLink1URL: http://www.semiconductors.philips.com/; ComponentLink2Description: Datasheet; ComponentLink2URL: http://www.semiconductors.philips.com/acrobat/datasheets/BSN20-03.pdf
R8 R9 R13-R26 R30-R34 = RES1
R10-R12 = ERJ6RK: Precision Thick Film Chip Resistor, 10 Ohm to 1M Ohm Range, 1% and 0.5% Tolerance, 0805 Size, 0.1 W; Manufacturer: Panasonic; Vendor: Digikey; Published: 17-Dec-2003; LatestRevisionDate: 19-Mar-2004; LatestRevisionNote: Silkscreen size reduced.; PackageDocument: Mar-2003; PackageReference: 6-0805; Publisher: Altium Limited; Code_IPC: 2012 [0805]; ComponentLink1Description: Manufacturer Link; ComponentLink1URL: http://www.panasonic.com/industrial/components/resistive_products.htm; ComponentLink2Description: Datasheet; ComponentLink2URL: http://www.panasonic.com/industrial/components/pdf/AOA0000CE2.pdf; Value: 10K; Digikey Part #: P10KATR-ND
R27 = CMP-1013-00001-1: 0R5 0805 (2012 Metric); Case-EIA: 0805; Value: 0.5 Ohm; Tolerance: 1%; Power: None; Case-Metric: 2012; Technology: SMT
TP5 = TP17: Test Point
TP6-TP11 = TP1
U2 = EP3C40F324C8N: Cyclone III Family FPGA, 195 I/O Pins, 4 PLLs, 324-Pin FBGA, Speed Grade 8, Commercial Grade, Pb-Free; Published: 26-Feb-2007; DatasheetVersion: ver2.0, May-2008; PackageVersion: ver16.0, Dec-2009; PackageReference: FBGA324; Publisher: Altium Limited; PackageDescription: 324-Ball FineLine Ball Grid Array (FBGA324) - Wire Bond; Supplier 1: Digi-Key; Supplier Part Number 1: 544-2486-ND; Supplier 2: Farnell; Supplier Part Number 2: 1635070; Code_JEDEC: MS-034-AAG-1; Code_IPC: BGA100P18X18-324; ComponentLink1Description: Manufacturer Link; ComponentLink1URL: http://www.altera.com/; ComponentLink2Description: Handbook (7.86MB); ComponentLink2URL: http://www.altera.com/literature/hb/cyc3/cyclone3_handbook.pdf; ComponentLink3Description: Packaging Specification; ComponentLink3URL: http://www.altera.com/literature/ds/dspkg.pdf
U5 = SX1503: i2C LV GPIO

## Sheet PP 8_14_2012.SchDoc
size 558 x 401 mm; Organization: Carnegie Institution of Washington; DocumentNumber: 1; SheetNumber: 1; SheetTotal: 2; PageSetup: Record=PageOptions|CenterHorizontal=True|CenterVertical=True|PrintScale=0.47|XCorrection=1.00|YCorrection=1.00|PrintKind=1|BorderSize=5000000|LeftOffset=0|BottomOffset=0|Orientation=2|PaperLength=1000|PaperWidth=1000|Scale=100|PaperSource=259|PrintQuality=600|MediaType=1|DitherType=10|PaperKind=Letter (8.5 x 11")|PrintScaleMode=1
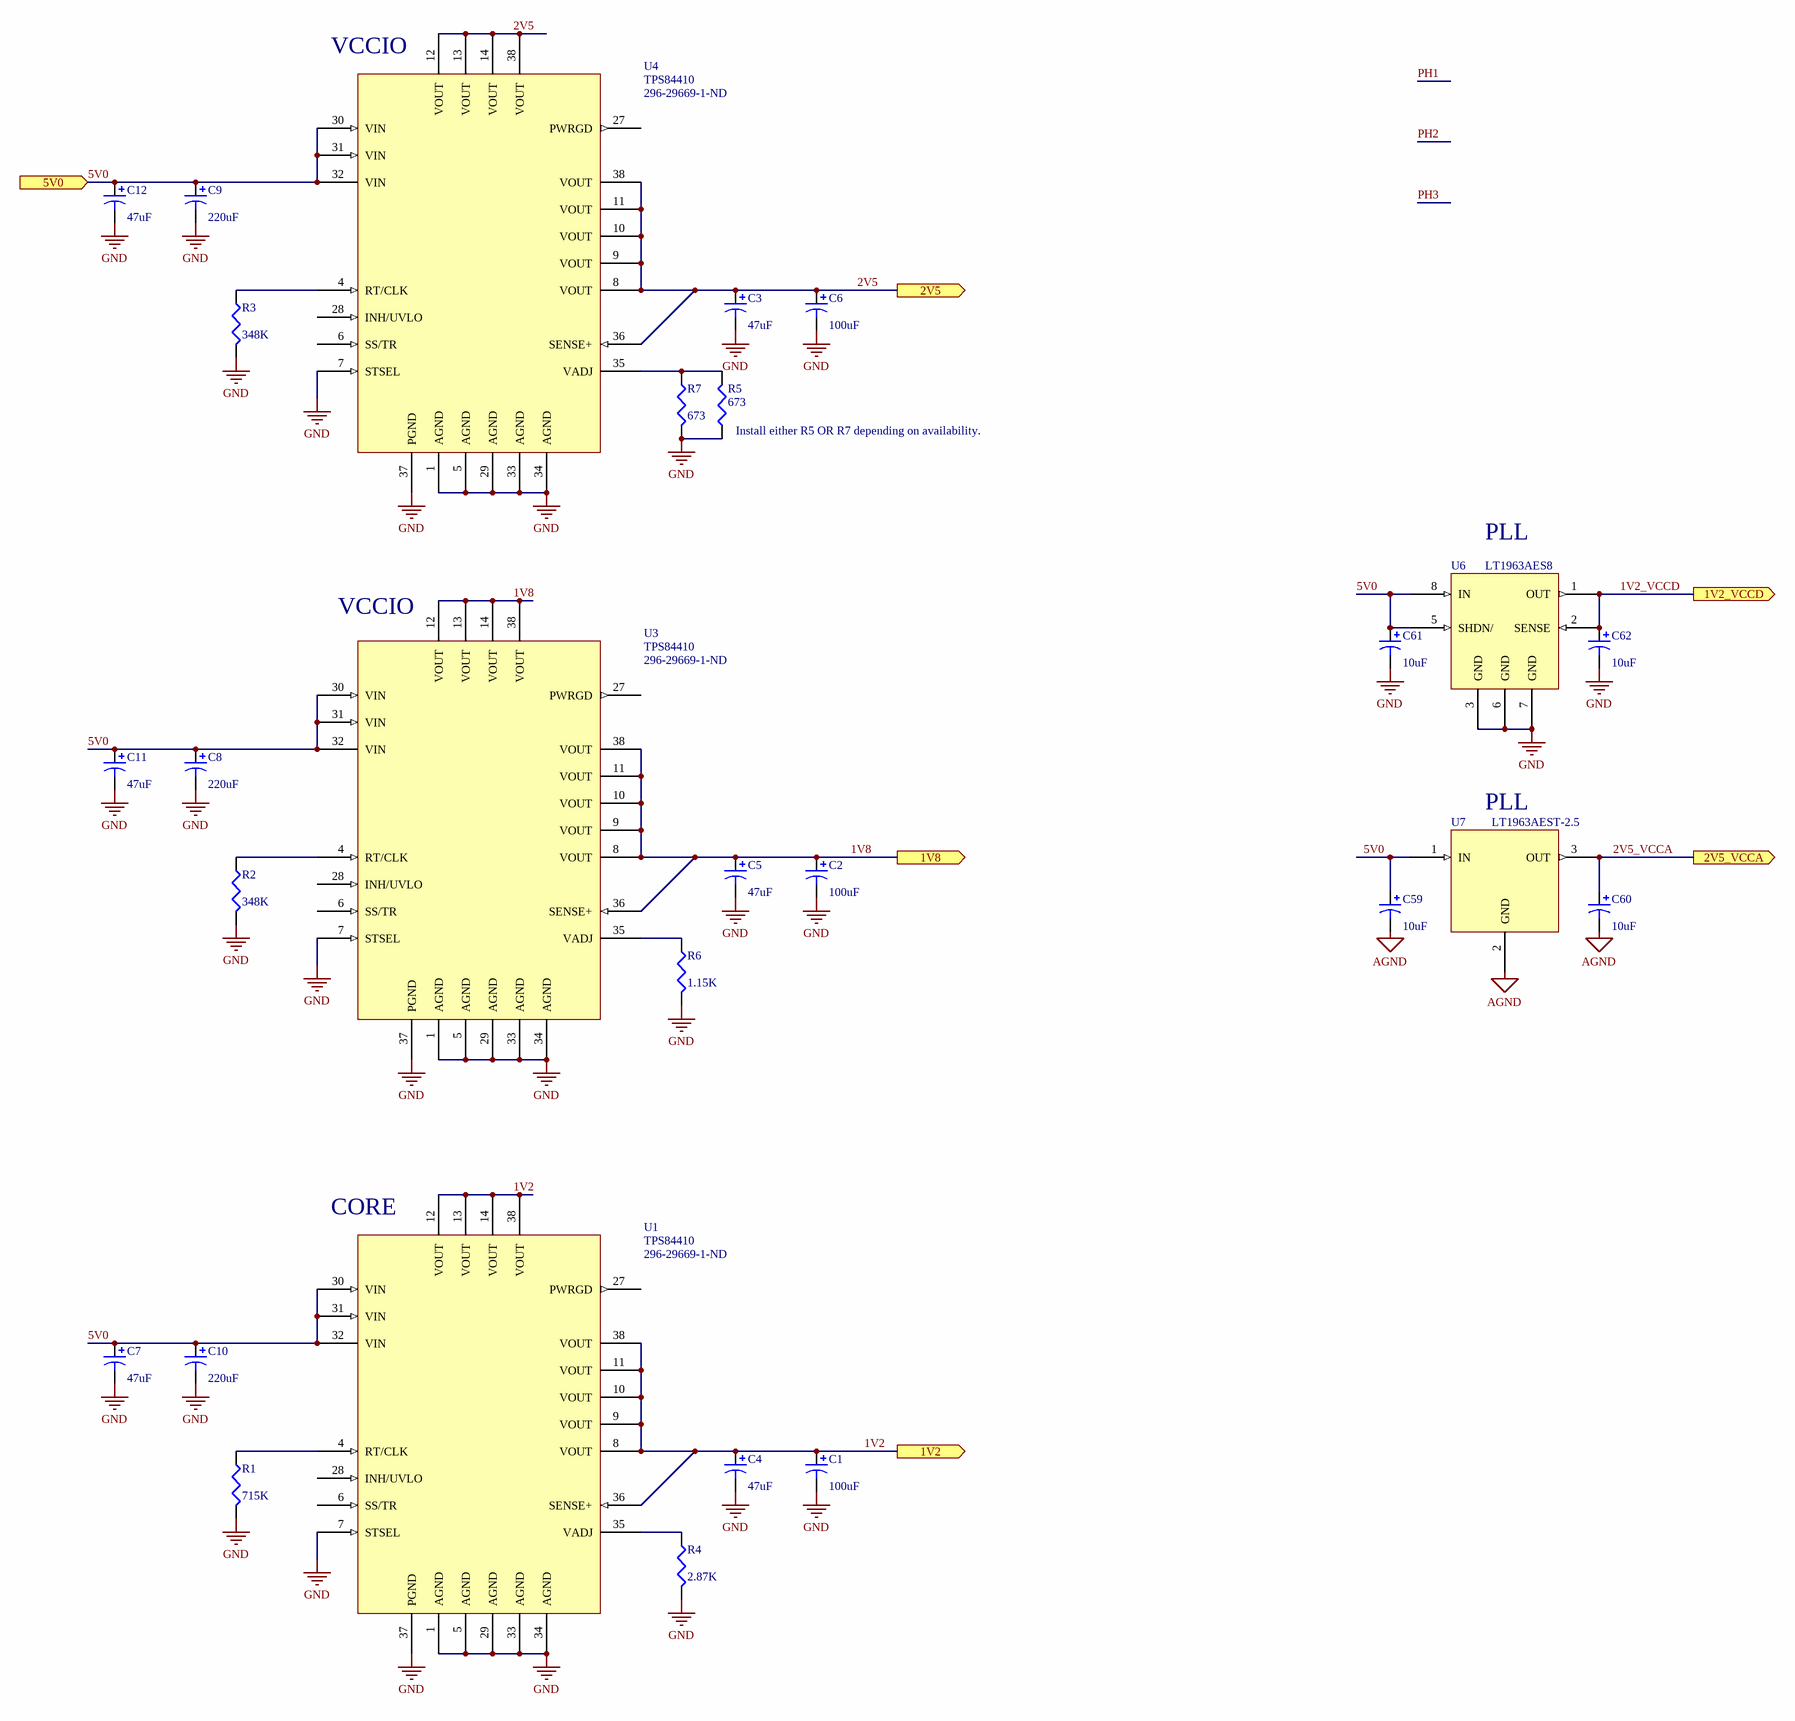
[diagram p3: PP 8_14_2012.SchDoc]

### Parts
C1  value 100uF  [TC3528-1411]  (hidden comment: 100 uF)
C2  value 100uF  [TC3528-1411]  (hidden comment: 100 uF)
C3  value 47uF  [TC3528-1411]  (hidden comment: 100 uF)
C4  value 47uF  [TC3528-1411]  (hidden comment: 47 uF)
C5  value 47uF  [TC3528-1411]  (hidden comment: 47 uF)
C6  value 100uF  [TC3528-1411]  (hidden comment: 47 uF)
C7  value 47uF  [TC3528-1411]  (hidden comment: 220uF)
C8  220uF  [TC3528-1411]
C9  220uF  [TC3528-1411]
C10  value 220uF  [TC3528-1411]  (hidden comment: 47uF)
C11  value 47uF  [TC3528-1411]  (hidden comment: 47 uF)
C12  value 47uF  [TC3528-1411]  (hidden comment: 47 uF)
C59  10uF  [1206]
C60  10uF  [1206]
C61  10uF  [1206]
C62  10uF  [1206]
R1  715K  [J1-0603]
R2  348K  [J1-0603]
R3  348K  [J1-0603]
R4  2.87K  [J1-0603]
R5  673  [RES 0.3 x 0.025]
R6  1.15K  [J1-0603]
R7  673  [J1-0603]
U1  TPS84410  Supplier Part Number 1: 296-29669-1-ND  [QFN-N39]
U3  TPS84410  Supplier Part Number 1: 296-29669-1-ND  [QFN-N39]
U4  TPS84410  Supplier Part Number 1: 296-29669-1-ND  [QFN-N39]
U6  LT1963AES8  [SO8_L]
U7  LT1963AEST-2.5  [SOT-223 LT1963A]

### Ports
1V2 (out), 1V2_VCCD (out), 1V8 (out), 2V5 (out), 2V5_VCCA (out), 5V0 (in)

### Nets
1V8: C2.1 C5.1 U3.8(VOUT) U3.9(VOUT) U3.10(VOUT) U3.11(VOUT) U3.12(VOUT) U3.13(VOUT) U3.14(VOUT) U3.36(SENSE+) U3.38(VOUT) ; port 1V8
2V5_VCCA: C60.1 U7.3(OUT) ; port 2V5_VCCA
5V0: C7.1 C8.1 C9.1 C10.1 C11.1 C12.1 C59.1 C61.1 U1.30(VIN) U1.31(VIN) U1.32(VIN) U3.30(VIN) U3.31(VIN) U3.32(VIN) U4.30(VIN) U4.31(VIN) U4.32(VIN) U6.5(SHDN/) U6.8(IN) U7.1(IN) ; port 5V0
AGND: C59.2 C60.2 U7.2(GND)
GND: C1.2 C2.2 C3.2 C4.2 C5.2 C6.2 C7.2 C8.2 C9.2 C10.2 C11.2 C12.2 C61.2 C62.2 R1.2 R2.2 R3.2 R4.2 R5.1 R6.2 R7.2 U1.1(AGND) U1.5(AGND) U1.7(STSEL) U1.29(AGND) U1.33(AGND) U1.34(AGND) U1.37(PGND) U3.1(AGND) U3.5(AGND) U3.7(STSEL) U3.29(AGND) U3.33(AGND) U3.34(AGND) U3.37(PGND) U4.1(AGND) U4.5(AGND) U4.7(STSEL) U4.29(AGND) U4.33(AGND) U4.34(AGND) U4.37(PGND) U6.3(GND) U6.6(GND) U6.7(GND)
1V2: C1.1 C4.1 U1.8(VOUT) U1.9(VOUT) U1.10(VOUT) U1.11(VOUT) U1.12(VOUT) U1.13(VOUT) U1.14(VOUT) U1.36(SENSE+) U1.38(VOUT) ; port 1V2
1V2_VCCD: C62.1 U6.1(OUT) U6.2(SENSE) ; port 1V2_VCCD
2V5: C3.1 C6.1 U4.8(VOUT) U4.9(VOUT) U4.10(VOUT) U4.11(VOUT) U4.12(VOUT) U4.13(VOUT) U4.14(VOUT) U4.36(SENSE+) U4.38(VOUT) ; port 2V5
NetR1_1: R1.1 U1.4(RT/CLK)
NetR2_1: R2.1 U3.4(RT/CLK)
NetR3_1: R3.1 U4.4(RT/CLK)
NetR4_1: R4.1 U1.35(VADJ)
NetR5_2: R5.2 R7.1 U4.35(VADJ)
NetR6_1: R6.1 U3.35(VADJ)

Not connected (* = marked no-connect by the designer): U1 6(SS/TR) 27(PWRGD) 28(INH/UVLO); U3 6(SS/TR) 27(PWRGD) 28(INH/UVLO); U4 6(SS/TR) 27(PWRGD) 28(INH/UVLO); U6 4(NC)

### Notes on the sheet
- (near U4) VCCIO
- (near R5) Install either R5 OR R7 depending on availability.
- (near U6) PLL
- (near U3) VCCIO
- (near U7) PLL
- (near U1) CORE
- Carnegie Institution of Washington
- 813 Santa Barbara Street
- The Observatories
- PHONE (626) 577-1122               FAX (626) 795-8136
- Pasadena, California 91101
- Title:
- OCIW
- Size:
- Date:
- C
- Scale:
- Drawn By:
- Checked By:
- A. BAGISH
- alanb
- Revision:
- Sheet          of
- File:

### Library data of the parts
C1 C2 C6 = Cap Pol3: Polarized Capacitor (Surface Mount); Description: CAP TANT 100UF 10V 20% 1210; AVX Corporation: TAJB107M010RNJ; Published: 8-Jun-2000; LatestRevisionDate: 29-May-2009; LatestRevisionNote: IPC-7351 Footprint Added.; PackageReference: TC3528-1411; Publisher: Altium Limited; PackageDescription: Chip Capacitor; Digi-Key: 478-5801-6-ND
C3-C5 C7 C11 C12 = Cap Pol3: Polarized Capacitor (Surface Mount); Description: CAP TANT 47UF 10V 10% 1411; Nichicon: F931A476KBA; Published: 8-Jun-2000; LatestRevisionDate: 29-May-2009; LatestRevisionNote: IPC-7351 Footprint Added.; PackageReference: TC3528-1411; Publisher: Altium Limited; PackageDescription: Chip Capacitor; Digi-Key: 493-4143-6-ND
C8-C10 = Cap Pol3: Polarized Capacitor (Surface Mount); Description: CAP TANT 220UF 10V 20% 1210; Nichicon: F950J227MBAAQ2; Published: 8-Jun-2000; LatestRevisionDate: 29-May-2009; LatestRevisionNote: IPC-7351 Footprint Added.; PackageReference: TC3528-1411; Publisher: Altium Limited; PackageDescription: Chip Capacitor; Digi-Key: 493-2918-6-ND
  C8 C9: Value: 220uF
C59-C62 = Cap Pol3: Polarized Capacitor (Surface Mount); Kemet: T491A106M016AT; Description: CAP TANT 10UF 16V 20% 1206; Published: 8-Jun-2000; LatestRevisionDate: 29-May-2009; PackageReference: C0805; Publisher: Altium Limited; PackageDescription: Chip Capacitor; Value: 10uF; Digi-Key: 399-3687-6-ND
R1 R4 = Res3: Resistor; Description: RES 2.87K OHM 1/10W 1% 0603 SMD; Panasonic - ECG: ERJ-3EKF2871V; Published: 8-Jun-2000; LatestRevisionDate: 29-May-2009; LatestRevisionNote: IPC-7351 Footprint Added.; PackageReference: 0603 (1608 Metric); Publisher: Altium Limited; PackageDescription: Chip Resistor
  R1: Value: 715K; Digikey: P715KHCT-ND
  R4: Value: 2.87K; Digikey: P2.87KHCT-ND
R2 R3 = Res3: Resistor; Description: RES 348K OHM 1/10W 1% 0603 SMD; Panasonic - ECG: ERJ-3EKF3483V; Published: 8-Jun-2000; LatestRevisionDate: 29-May-2009; LatestRevisionNote: IPC-7351 Footprint Added.; PackageReference: 0603 (1608 Metric); Publisher: Altium Limited; PackageDescription: Chip Resistor; Value: 348K; Digikey: P348KHCT-ND
R5 R7 = Res3: Resistor; Description: Metal Film Resistors - Through Hole 1/8watt 673ohms .1% 10ppm; Vishay/Dale: PTF56673R00BYEK; Published: 8-Jun-2000; LatestRevisionDate: 29-May-2009; LatestRevisionNote: IPC-7351 Footprint Added.; PackageReference: J1-0603; Publisher: Altium Limited; PackageDescription: 6.35MM AXIAL; Value: 673; Metal Film ResistMOUSER: 71-PTF56673R00BYEK
R6 = Res3: Resistor; Description: RES 1.15K OHM 1/10W 1% 0603 SMD; Panasonic - ECG: ERJ-3EKF1151V; Published: 8-Jun-2000; LatestRevisionDate: 29-May-2009; LatestRevisionNote: IPC-7351 Footprint Added.; PackageReference: J1-0603; Publisher: Altium Limited; PackageDescription: 0603 (1608 Metric); Value: 1.15K; Digikey: P1.15KHCT-ND
U6 = LT1963A
U1 U3 U4 = TPS84410: Supplier 1: Digi-Key

## Nets that join several sheets
1V8: M2FS FLS Data Formatter 8_14_2012 (33 pins), PP 8_14_2012 (11 pins)
2V5_VCCA: M2FS FLS Data Formatter 8_14_2012 (5 pins), PP 8_14_2012 (C60.1 U7.3)
5V0: M2FS FLS Data Formatter 8_14_2012 (10 pins), PP 8_14_2012 (20 pins)
AGND: M2FS FLS Data Formatter 8_14_2012 (8 pins), PP 8_14_2012 (C59.2 C60.2 U7.2)
GND: M2FS FLS Data Formatter 8_14_2012 (171 pins), PP 8_14_2012 (45 pins)
1V2: M2FS FLS Data Formatter 8_14_2012 (46 pins), PP 8_14_2012 (11 pins)
1V2_VCCD: M2FS FLS Data Formatter 8_14_2012 (L2.1 Test_Point_6.1), PP 8_14_2012 (C62.1 U6.1 U6.2)
2V5: M2FS FLS Data Formatter 8_14_2012 (27 pins), PP 8_14_2012 (11 pins)